# Altium project mldc_gd.PrjPcb
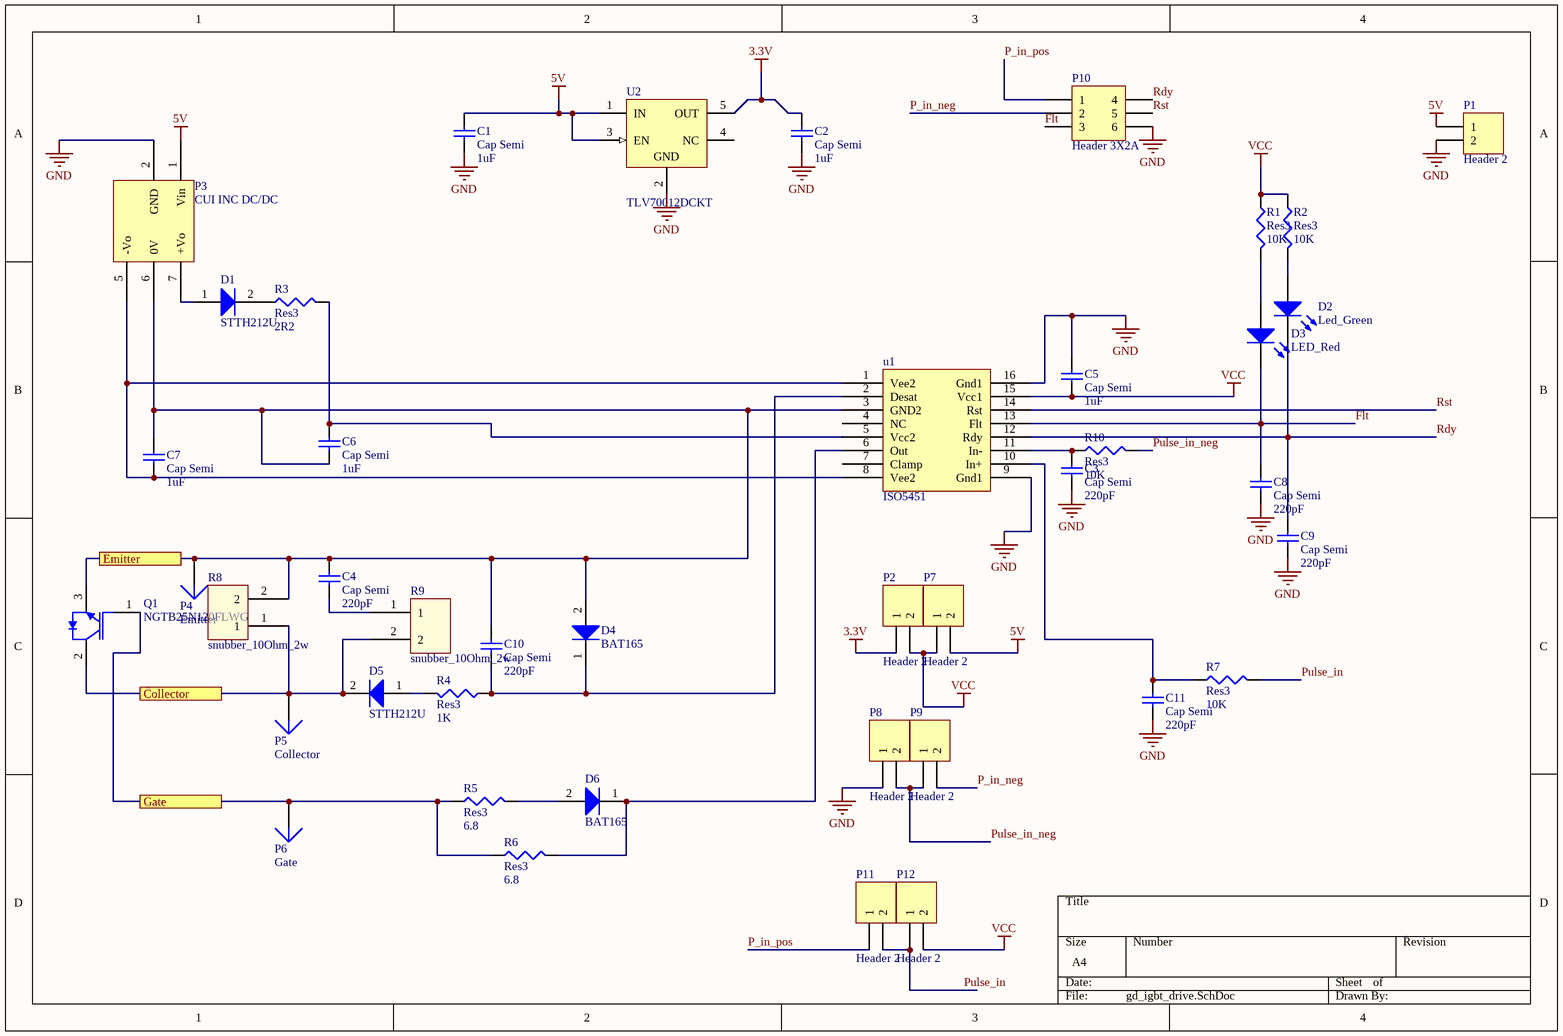
[diagram p0: gd_igbt_drive.SchDoc]
1 sheet, 42 parts. Net scope: flat (ports and power ports of the same name join across sheets).

## Sheet gd_igbt_drive.SchDoc
size A4

### Parts
C1  Cap Semi  value 1uF  [6-0805_M]
C2  Cap Semi  value 1uF  [6-0805_M]
C3  Cap Semi  value 220pF  [6-0805_M]
C4  Cap Semi  value 220pF  [C1206]
C5  Cap Semi  value 1uF  [6-0805_M]
C6  Cap Semi  value 1uF  [6-0805_M]
C7  Cap Semi  value 1uF  [6-0805_M]
C8  Cap Semi  value 220pF  [6-0805_M]
C9  Cap Semi  value 220pF  [6-0805_M]
C10  Cap Semi  value 220pF  [6-0805_M]
C11  Cap Semi  value 220pF  [6-0805_M]
D1  STTH212U  [GESC-GAP3SLT33-214-2_V]
D2  Led_Green  [3.2X1.6X1.1]
D3  LED_Red  [3.2X1.6X1.1]
D4  BAT165  [ONSC-SOD-323-2-477-02_V]
D5  STTH212U  [GESC-GAP3SLT33-214-2_V]
D6  BAT165  [ONSC-SOD-323-2-477-02_V]
P1  Header 2  [HDR1X2]
P2  Header 2  [HDR1X2]
P3  CUI INC DC/DC  [DIP10]
P4  Emitter  [PIN1]
P5  Collector  [PIN1]
P6  Gate  [PIN1]
P7  Header 2  [HDR1X2]
P8  Header 2  [HDR1X2]
P9  Header 2  [HDR1X2]
P10  Header 3X2A  [HDR2X3_CEN]
P11  Header 2  [HDR1X2]
P12  Header 2  [HDR1X2]
Q1  NGTB25N120FLWG  [ONSC-TO-247-3-340L-02]
R1  Res3  value 10K  [6-0805_M]
R2  Res3  value 10K  [6-0805_M]
R3  Res3  value 2R2  [6-0805_M]
R4  Res3  value 1K  [6-0805_M]
R5  Res3  value 6.8  [6-0805_M]
R6  Res3  value 6.8  [6-0805_M]
R7  Res3  value 10K  [6-0805_M]
R8  snubber_10Ohm_2w  [SMDres]
R9  snubber_10Ohm_2w  [SMDres]
R10  Res3  value 10K  [6-0805_M]
u1  ISO5451  [SOIC127P1030X265-16M]
U2  TLV70012DCKT  [DCK0005A_L]

### Ports
Collector, Emitter, Gate

### Nets
3.3V: C2.2 P2.1 U2.5(OUT)
5V: C1.2 P1.1 P3.1(Vin) P7.2 U2.1(IN) U2.3(EN)
GND: C1.1 C2.1 C3.1 C5.1 C8.1 C9.1 C11.1 P1.2 P3.2(GND) P8.1 P10.6 u1.9(Gnd1) u1.16(Gnd1) U2.2(GND)
VCC: C5.2 P2.2 P7.1 P12.2 R1.1 R2.1 u1.15(Vcc1)
Flt: C8.2 D3.2(K) P10.3 u1.13(Flt)
P_in_neg: P9.2 P10.2
P_in_pos: P10.1 P11.1
Pulse_in: P11.2 P12.1 R7.2
Pulse_in_neg: P8.2 P9.1 R10.2
Rdy: C9.2 D2.2(K) P10.4 u1.12(Rdy)
Rst: P10.5 u1.14(Rst)
NetC3_2: C3.2 R10.1 u1.11(In-)
NetC4_1: C4.1 C6.2 C7.2 C10.1 D4.2(A) P3.6(0V) P4.1 Q1.3(E) R8.2 u1.3(GND2) ; port Emitter
NetC4_2: C4.2 R9.1
NetC6_1: C6.1 R3.2 u1.5(Vcc2)
NetC7_1: C7.1 P3.5(-Vo) u1.1(Vee2) u1.8(Vee2)
NetC10_2: C10.2 D4.1(K) R4.1 u1.2(Desat)
NetC11_2: C11.2 R7.1 u1.10(In+)
NetD1_1: D1.1(A) P3.7(+Vo)
NetD1_2: D1.2 R3.1
NetD2_1: D2.1(A) R2.2
NetD3_1: D3.1(A) R1.2
NetD5_1: D5.1(A) R4.2
NetD5_2: D5.2 P5.1 Q1.2(C) R8.1 R9.2 ; port Collector
NetD6_1: D6.1(K) R6.2 u1.6(Out)
NetD6_2: D6.2(A) R5.2
NetP6_1: P6.1 Q1.1(G) R5.1 R6.1 ; port Gate

Not connected (* = marked no-connect by the designer): u1 4(NC) 7(Clamp); U2 4(NC)

### Library data of the parts
C1-C11 = Cap Semi: Capacitor (Semiconductor SIM Model); Published: 8-Jun-2000; LatestRevisionDate: 29-May-2009; LatestRevisionNote: IPC-7351 Footprint Added.; PackageReference: C1206; Publisher: Altium Limited; PackageDescription: Chip Capacitor
D1 D5 = CMP-2000-05135-1: Silicon Carbide Power Schottky Diode, 3300 V, - 0.3 A, -55 to 175 degC, 2-Pin SMD, RoHS, Tape and Reel; Vf - Forward Voltage: 4V; Vrrm - Repetitive Reverse Voltage: 3300V; Brand: GeneSiCSemiconductor; Ifsm - Forward Surge Current: 10A; If - Forward Current: 0.3A; Pd - Power Dissipation: 25W; Package Version: Rev. 1, 11/2013; Unit Weight: 0.003284oz; Ir - Reverse Current: 100uA; trr - Reverse Recovery time: 60ns; Configuration: Single; Maximum Operating Temperature: +175C; Factory Pack Quantity: 2500; Package Description: 2-Pin Chip, Body 4.57 x 3.94 mm; Product Category: SchottkyDiodes&Rectifiers; Minimum Operating Temperature: -55C; Manufacturer: GeneSiCSemiconductor; Technology: SiC; Datasheet Version: Rev. 1, 11/2013; Package / Case: DO-214AA; Product: SchottkySiliconCarbideDiodes; Datasheet URL: https://datasheet.ciiva.com/24141/gap3slt33-214-271329-24141300.pdf; Operating Temperature Range: -55Cto+175C; RoHS: True; Mounting Style: SMD/SMT; Packaging: Reel; Series: GAP3SLT33; Package URL: https://datasheet.ciiva.com/24141/gap3slt33-214-271329-24141300.pdf; Manufacturer URL: http://www.genesicsemi.com/
D2 D3 = LED2: Typical RED, GREEN, YELLOW, AMBER GaAs LED; Published: 8-Jun-2000; LatestRevisionDate: 17-Jul-2002; LatestRevisionNote: Re-released for DXP Platform.; PackageVersion: Feb-2002; PackageReference: 3.2X1.6X1.1; Publisher: Altium Limited; PackageDescription: SM LED; 2 Flat Leads
D4 D6 = CMP-1055-00472-1: Schottky Barrier Diode, 2-Pin SOD-323, Pb-Free, Tape and Reel; PartNumber: NSR0340HT1G; Manufacturer: On Semiconductor; IFSM Max (A): 1; Configuration: Single; PackageDescription: 2-Pin SOD, Body 1.7 x 1.25 mm; ComponentLink2Description: Datasheet; ComponentLink3URL: http://www.onsemi.com/pub_link/Collateral/477-02.PDF.1; Packing: Tape and Reel; PackageVersion: Rev. H, 03/2007; ComponentLink1URL: http://www.onsemi.com/; ComponentLink2URL: http://www.onsemi.cn/pub_link/Collateral/NSR0340H-D.PDF; ComponentLink3Description: Package Specification; ComponentLink1Description: Manufacturer URL; Mounting Technology: Surface Mount; RoHS: TRUE; PackageReference: SOD-323-2-477-02; DatasheetVersion: Rev. 1
P1 P2 P7-P9 P11 P12 = Header 2: Header, 2-Pin; LatestRevisionDate: 17-Jul-2002; LatestRevisionNote: Re-released for DXP Platform.; Publisher: Altium Limited
P3 = Component_1: Isolated DC DC Converter; LatestRevisionDate: 17-Jul-2002; LatestRevisionNote: Re-released for DXP Platform.; Publisher: Altium Limited
P4-P6 = Plug: LatestRevisionDate: 17-Jul-2002; LatestRevisionNote: Re-released for DXP Platform.; Publisher: Altium Limited
P10 = Header 3X2A: Header, 3-Pin, Dual row; LatestRevisionDate: 17-Jul-2002; LatestRevisionNote: Re-released for DXP Platform.; Publisher: Altium Limited
Q1 = CMP-1064-00043-1: IGBT, 25 A, 1200 V, 3-Pin TO-247, Pb-Free, Tube; Manufacturer: On Semiconductor; PackageVersion: Rev. F, 10/2011; RoHS: Pb-Free; DatasheetVersion: Rev. 0; ComponentLink1Description: Manufacturer URL; PackageReference: TO-247-3-340L-02; PartNumber: NGTB25N120FLWG; PackageDescription: 3-Pin Flange Mount, Vertical Straight Lead, Body 16.005 x 5 mm, Pitch 5.45 mm; ComponentLink1URL: http://www.onsemi.com/; ComponentLink3URL: http://www.onsemi.cn/pub_link/Collateral/340L-02.PDF; ComponentLink2URL: http://www.onsemi.com/pub_link/Collateral/NGTB25N120FLW-D.PDF; ComponentLink2Description: Datasheet; Mounting Technology: Through Hole; ComponentLink3Description: Package Specification; Packing: Tube
R1-R7 R10 = Res3: Resistor; Published: 8-Jun-2000; LatestRevisionDate: 29-May-2009; LatestRevisionNote: IPC-7351 Footprint Added.; PackageReference: J1-0603; Publisher: Altium Limited; PackageDescription: Chip Resistor
R8 R9 = Shunt resistor: SMD Shunt resistor
u1 = Component_1
U2 = CMP-0394-00926-2: Single Output LDO, 200 mA, Fixed 1.2 V Output, 2 to 5.5 V Input, with Low IQ, 5-pin SC70 (DCK), -40 to 125 degC, Green (RoHS & no Sb/Br); Manufacturer: Texas Instruments; SubFamily: Single Channel LDO; Fixed Output Options(V): 1.2; Iout(Max)(A): 0.2; Vin(Min)(V): 2; Iq(Typ)(mA): 0.03; Vin(Max)(V): 5.5; Vdo(Typ)(mV): 175; Code_JEDEC: MO-203; PackageDescription: 5-Pin Plastic Small-Outline, Body 2 x 1.25 mm, Pitch 0.65 mm; ComponentLink2URL: http://www.ti.com/general/docs/lit/getliterature.tsp?genericPartNumber=TLV70012&fileType=pdf; Accuracy(%): 2; ComponentLink1URL: http://www.ti.com/; Mounting Technology: Surface Mount; Vout Adj(Max)(V): 1.2; ComponentLink2Description: Datasheet; ComponentLink3URL: http://www.ti.com/litv/pdf/mpds025f; DatasheetVersion: SLVSA00D; PackageReference: DCK0005A; ComponentLink1Description: Manufacturer URL; Eco-Plan: Green (RoHS & no Sb/Br); ComponentLink3Description: Package Specification; PackageVersion: 4093553-3/G; PartNumber: TLV70012DCKT; Vout Adj(Min)(V): 1.2